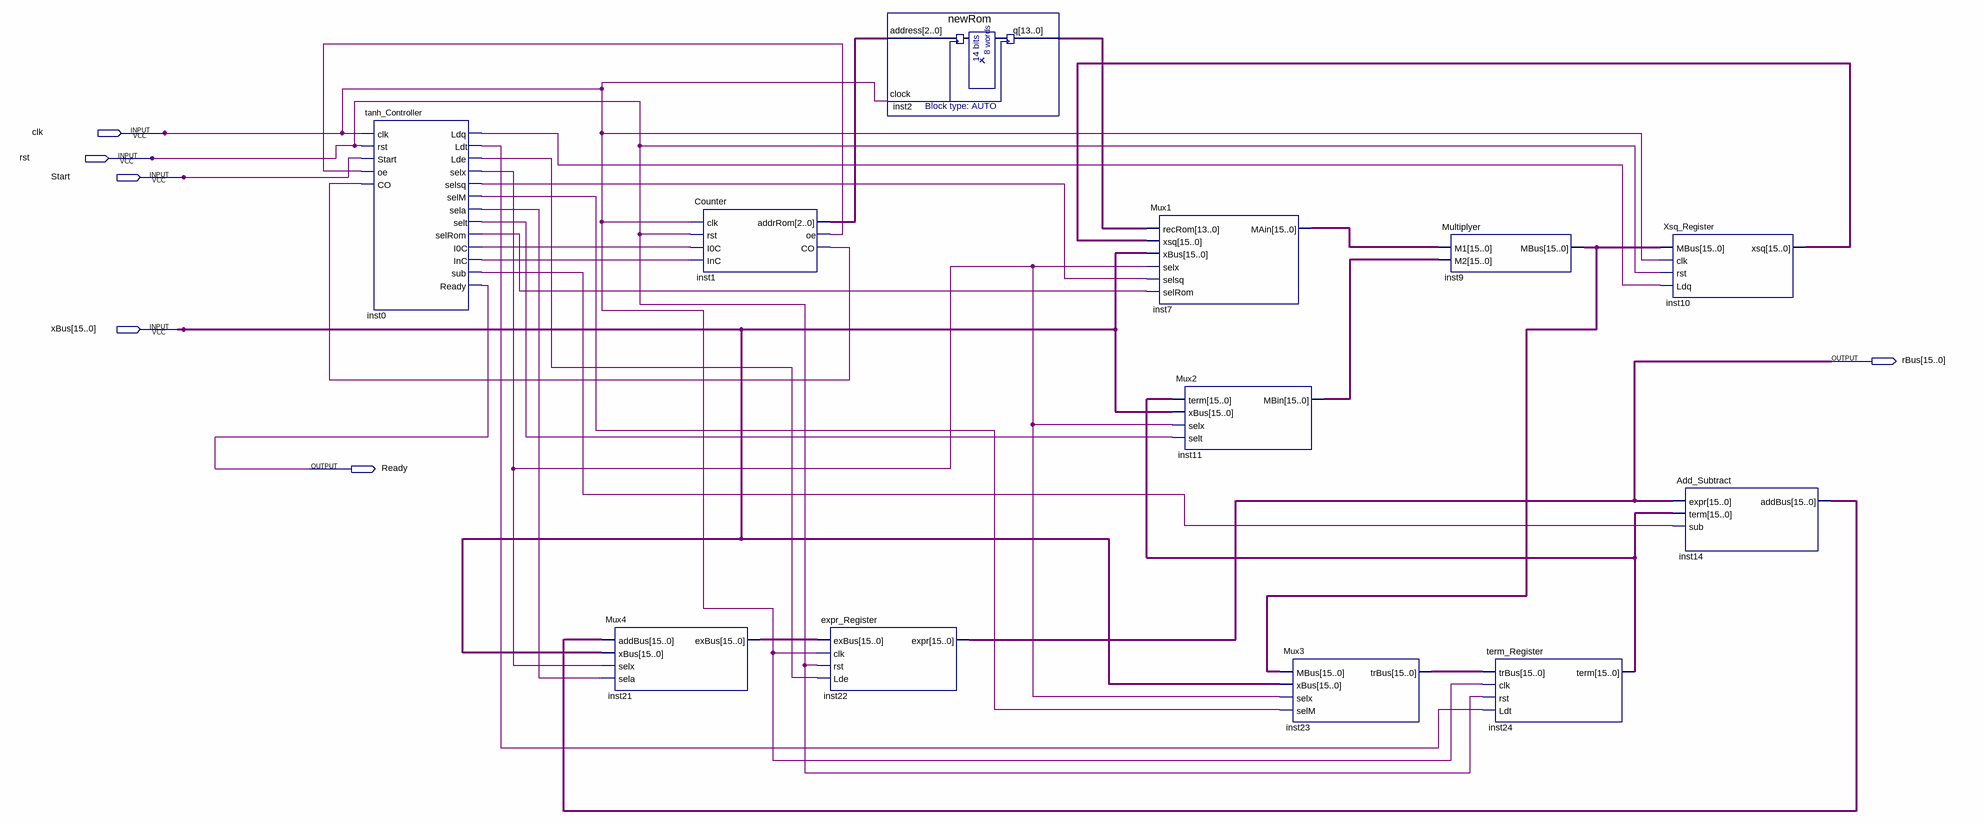
[diagram p0: schematic sheet]
// Quartus schematic test.bdf as structural Verilog: 12 symbols, 6 pins
module test (
  input  clk,
  input  rst,
  input  Start,
  input  [15:0] xBus,
  output [15:0] rBus,
  output Ready
);

  wire inst0_i0c, inst0_inc, inst0_lde, inst0_ldq, inst0_ldt, inst0_sela, inst0_selm, inst0_selrom,
       inst0_selsq, inst0_selt, inst0_selx, inst0_sub, inst1_co, inst1_oe;
  wire [2:0] inst1_addrrom;
  wire [13:0] inst2_q;
  wire [15:0] inst7_main, inst9_mbus, inst10_xsq, inst11_mbin, inst14_addbus, inst21_exbus, inst23_trbus,
       inst24_term;

  tanh_Controller inst0 (
    .clk(clk), .rst(rst), .Start(Start), .oe(inst1_oe), .CO(inst1_co), .Ldq(inst0_ldq), .Ldt(inst0_ldt),
    .Lde(inst0_lde), .selx(inst0_selx), .selsq(inst0_selsq), .selM(inst0_selm), .sela(inst0_sela),
    .selt(inst0_selt), .selRom(inst0_selrom), .I0C(inst0_i0c), .InC(inst0_inc), .sub(inst0_sub), .Ready(Ready));
  Mux4 inst21 (.addBus(inst14_addbus), .xBus(xBus), .selx(inst0_selx), .sela(inst0_sela), .exBus(inst21_exbus));
  Counter inst1 (
    .clk(clk), .rst(rst), .I0C(inst0_i0c), .InC(inst0_inc), .addrRom(inst1_addrrom), .oe(inst1_oe),
    .CO(inst1_co));
  expr_Register inst22 (.exBus(inst21_exbus), .clk(clk), .rst(rst), .Lde(inst0_lde), .expr(rBus));
  newRom inst2 (.address(inst1_addrrom), .clock(clk), .q(inst2_q));
  Mux1 inst7 (
    .recRom(inst2_q), .xsq(inst10_xsq), .xBus(xBus), .selx(inst0_selx), .selsq(inst0_selsq),
    .selRom(inst0_selrom), .MAin(inst7_main));
  Mux2 inst11 (.term(inst24_term), .xBus(xBus), .selx(inst0_selx), .selt(inst0_selt), .MBin(inst11_mbin));
  Mux3 inst23 (.MBus(inst9_mbus), .xBus(xBus), .selx(inst0_selx), .selM(inst0_selm), .trBus(inst23_trbus));
  Multiplyer inst9 (.M1(inst7_main), .M2(inst11_mbin), .MBus(inst9_mbus));
  term_Register inst24 (.trBus(inst23_trbus), .clk(clk), .rst(rst), .Ldt(inst0_ldt), .term(inst24_term));
  Xsq_Register inst10 (.MBus(inst9_mbus), .clk(clk), .rst(rst), .Ldq(inst0_ldq), .xsq(inst10_xsq));
  Add_Subtract inst14 (.expr(rBus), .term(inst24_term), .sub(inst0_sub), .addBus(inst14_addbus));
endmodule
